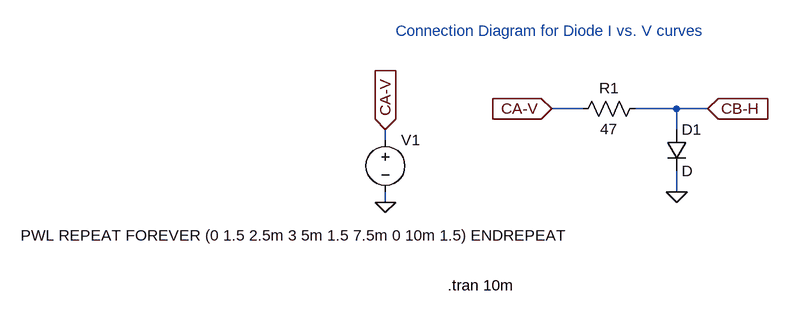
[diagram p0: schematic diode_conn_i_vs_v_ltspice.asc]
diode_conn_i_vs_v_ltspice.asc, the LTspice schematic file:
Version 4
SHEET 1 880 680
WIRE 96 144 48 144
WIRE 240 144 176 144
WIRE 288 144 240 144
WIRE 240 176 240 144
WIRE -208 192 -208 176
WIRE 240 272 240 240
WIRE -208 288 -208 272
FLAG 240 272 0
FLAG 48 144 CA-V
IOPIN 48 144 In
FLAG 288 144 CB-H
IOPIN 288 144 In
FLAG -208 288 0
FLAG -208 176 CA-V
IOPIN -208 176 In
SYMBOL res 192 128 R90
WINDOW 0 0 56 VBottom 2
WINDOW 3 32 56 VTop 2
SYMATTR InstName R1
SYMATTR Value 47
SYMBOL diode 224 176 R0
SYMATTR InstName D1
SYMBOL voltage -208 176 R0
WINDOW 3 -561 163 Left 2
WINDOW 123 0 0 Left 0
WINDOW 39 0 0 Left 0
SYMATTR InstName V1
SYMATTR Value PWL REPEAT FOREVER (0 1.5 2.5m 3 5m 1.5 7.5m 0 10m 1.5) ENDREPEAT
TEXT -112 416 Left 2 !.tran 10m
TEXT -192 24 Left 2 ;Connection Diagram for Diode I vs. V curves

The netlist it stands for:
* diode_conn_i_vs_v_ltspice.asc
R1 CB-H CA-V 47
D1 CB-H 0 D
V1 CA-V 0 PWL REPEAT FOREVER (0 1.5 2.5m 3 5m 1.5 7.5m 0 10m 1.5) ENDREPEAT
.model D D
.lib standard.dio
.tran 10m
* Connection Diagram for Diode I vs. V curves
.backanno
.end